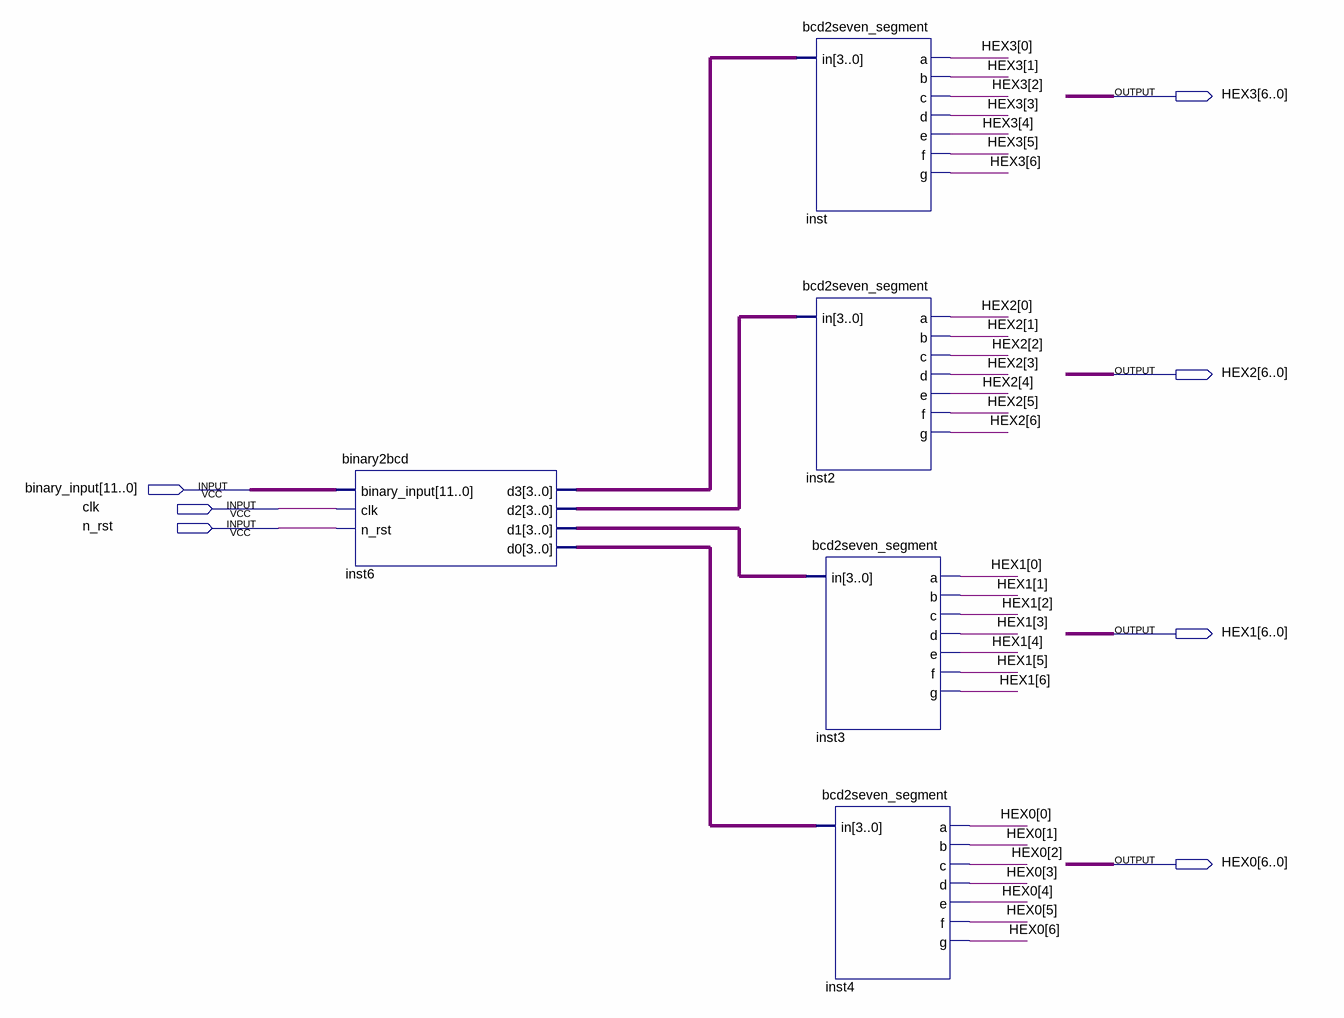
[diagram p0: schematic sheet]
// Quartus schematic binary2seven_segment.bdf as structural Verilog: 5 symbols, 7 pins
module binary2seven_segment (
  input  [11:0] binary_input,
  input  clk,
  input  n_rst,
  output [6:0] HEX3,
  output [6:0] HEX2,
  output [6:0] HEX1,
  output [6:0] HEX0
);

  wire [3:0] inst6_d0, inst6_d1, inst6_d2, inst6_d3;

  binary2bcd inst6 (
    .binary_input(binary_input), .clk(clk), .n_rst(n_rst), .d3(inst6_d3), .d2(inst6_d2), .d1(inst6_d1),
    .d0(inst6_d0));
  bcd2seven_segment inst (
    .in(inst6_d3), .a(HEX3[0]), .b(HEX3[1]), .c(HEX3[2]), .d(HEX3[3]), .e(HEX3[4]), .f(HEX3[5]), .g(HEX3[6]));
  bcd2seven_segment inst2 (
    .in(inst6_d2), .a(HEX2[0]), .b(HEX2[1]), .c(HEX2[2]), .d(HEX2[3]), .e(HEX2[4]), .f(HEX2[5]), .g(HEX2[6]));
  bcd2seven_segment inst3 (
    .in(inst6_d1), .a(HEX1[0]), .b(HEX1[1]), .c(HEX1[2]), .d(HEX1[3]), .e(HEX1[4]), .f(HEX1[5]), .g(HEX1[6]));
  bcd2seven_segment inst4 (
    .in(inst6_d0), .a(HEX0[0]), .b(HEX0[1]), .c(HEX0[2]), .d(HEX0[3]), .e(HEX0[4]), .f(HEX0[5]), .g(HEX0[6]));
endmodule
